# Altium schematic sheet KCNFEQ_V0.1.SchDoc
size A4
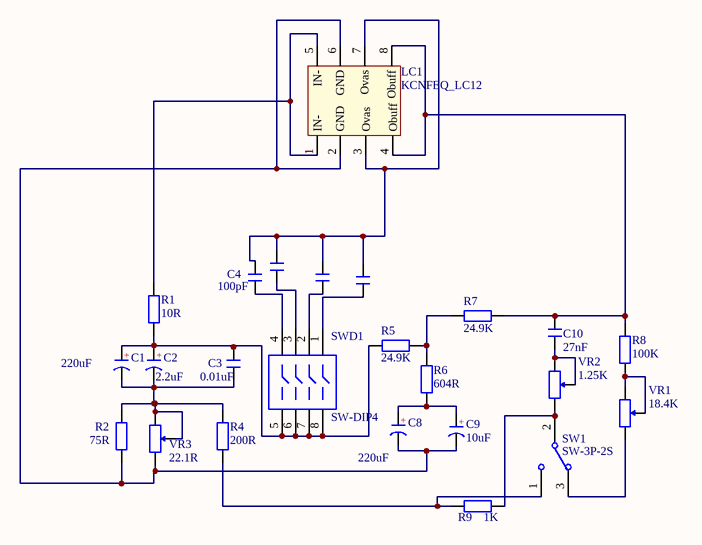
[diagram p0: KCNFEQ_V0.1.SchDoc]

## Parts
C1  220uF  [CAP 5.0*10*12.5]
C2  2.2uF  [CAP 5.0*10*12.5]
C3  0.01uF  [CBB 6.3*6.3*5]
C4  100pF  [CBB 6.3*6.3*5]
C6  100pF  [CBB 6.3*6.3*5]  (value not drawn)
C7  20pF  [CBB 6.3*6.3*5]  (value not drawn)
C8  220uF  [CAP 5.0*10*12.5]
C9  10uF  [CAP 5.0*10*12.5]
C10  27nF  [CBB 6.3*6.3*5]
C18  60pF  [CBB 6.3*6.3*5]  (value not drawn)
LC1  KCNFEQ_LC12  [LC12-3.81]
R1  10R  [RS 1/4W]
R2  75R  [RS 1/4W]
R4  200R  [RS 1/4W]
R5  24.9K  [RS 1/4W]
R6  604R  [RS 1/4W]
R7  24.9K  [RS 1/4W]
R8  100K  [RS 1/4W]
R9  1K  [RS 1/4W]
SW1  SW-3P-2S  [SS-12D06]
SWD1  SW-DIP4  [DIP-8]
VR1  18.4K  [RS 1/2W-VR]
VR2  1.25K  [RS 1/2W-VR]
VR3  22.1R  [RS 1/2W-VR]

## Nets
NetC1_1: C1.1(A) C2.1(A) C3.1 R1.1 R5.1 SWD1.5 SWD1.6 SWD1.7 SWD1.8
NetC1_2: C1.2(K) C2.2(K) C3.2 R2.2 R4.2 VR3.1 VR3.3
NetC4_1: C4.1 SWD1.4
NetC4_2: C4.2 C6.2 C7.2 C18.2 LC1.3(Ovas) LC1.7(Ovas)
NetC6_1: C6.1 SWD1.2
NetC7_1: C7.1 SWD1.1
NetC8_1: C8.1(A) C9.1(A) R6.1
NetC8_2: C8.2(K) C9.2(K) LC1.2(GND) LC1.6(GND) R2.1 VR3.2
NetC10_1: C10.1 LC1.4(Obuff) LC1.8(Obuff) R7.2 R8.1
NetC10_2: C10.2 VR2.1 VR2.3
NetC18_1: C18.1 SWD1.3
NetLC1_1: LC1.1(IN-) LC1.5(IN-) R1.2
NetR4_1: R4.1 R9.1 SW1.1
NetR5_2: R5.2 R6.2 R7.1
NetR8_2: R8.2 VR1.1 VR1.3
NetR9_2: R9.2 SW1.2 VR2.2
NetSW1_3: SW1.3 VR1.2

## Notes on the sheet
- (in symbol C-CAP) +

## Library data of the parts
C1 C2 C8 C9 = C-CAP: 直插电解电容; 版权归属: 源创客; BOM名称: 直插电解电容; 学习资源: www.ooocke.com
C3 C4 C6 C7 C10 C18 = C-CBB: CBB电容; 版权归属: 源创客; BOM名称: CBB电容; 学习资源: www.ooocke.com
LC1 = KCNFEQ_LC12: King Cello Negative Feedback and EQ Board
R1 R2 R4-R9 = R-CRR: 直插色环电阻; BOM名称: 色环电阻; 版权归属: 源创客; 学习资源: www.ooocke.com
SW1 = SW-3P-2S: 3 Pin 2 Switch
SWD1 = SW-DIP4: DIP Switch; Published: 24-Mar-1999; LatestRevisionDate: 17-Jul-2002; LatestRevisionNote: Re-released for DXP Platform.; PackageReference: DIP-8; Publisher: Altium Limited
VR1-VR3 = VR-W: 直插可调电阻-顶调